# Altium schematic sheet pqm_v2_page2.SchDoc
size A4
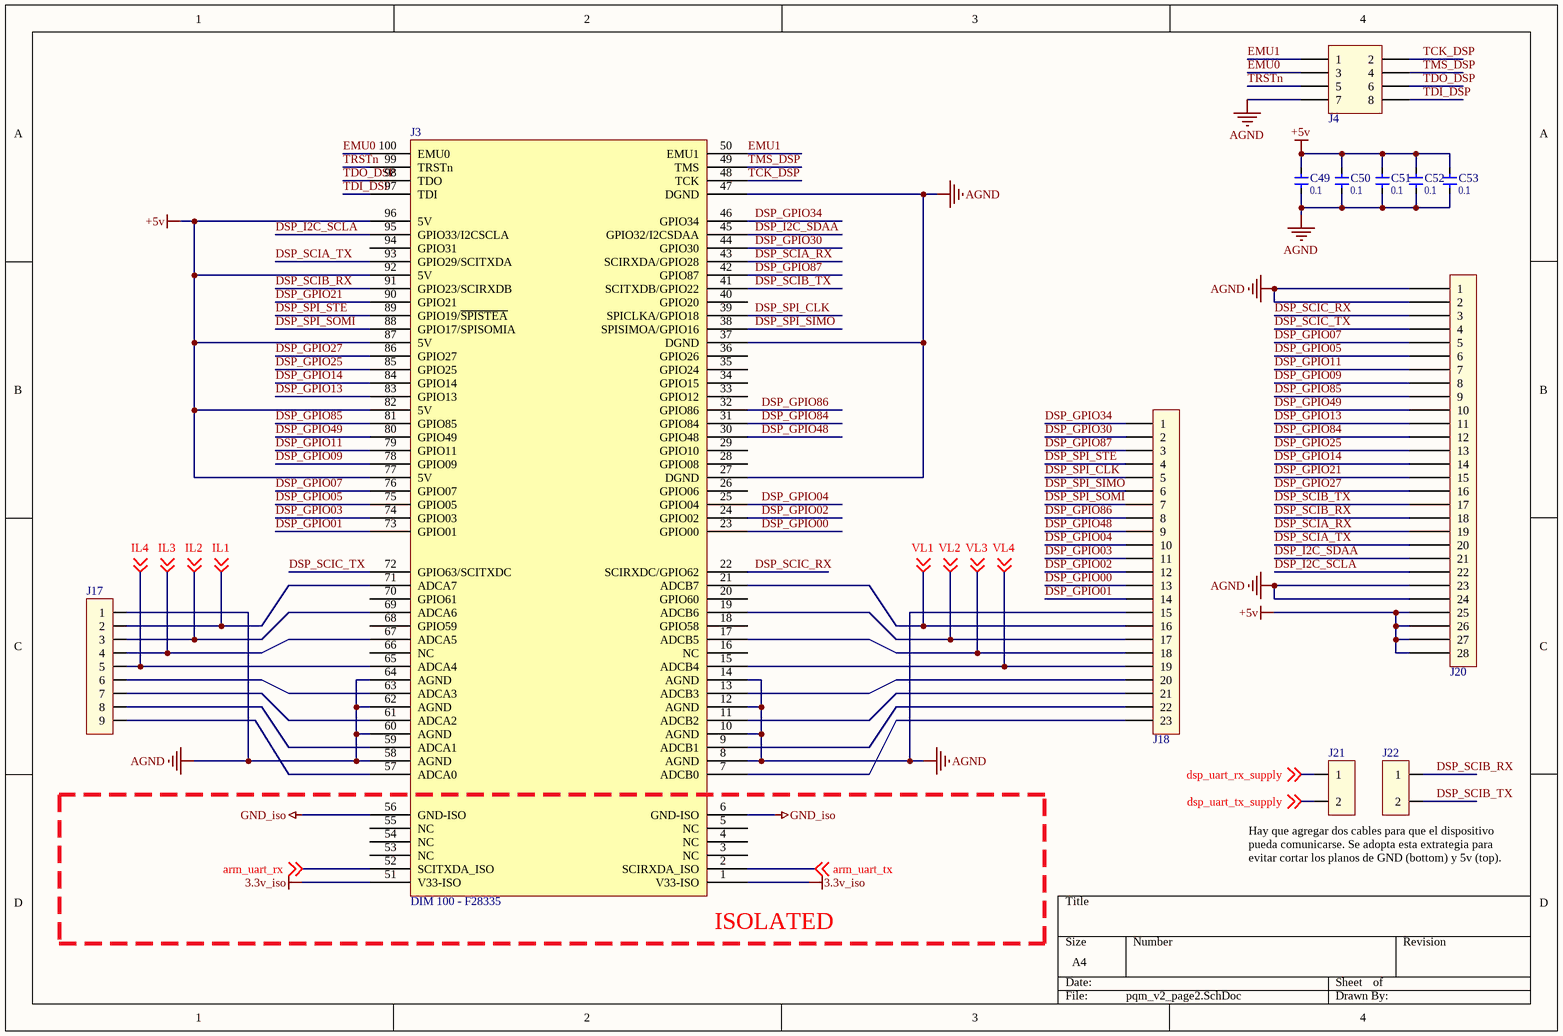
[diagram p0: pqm_v2_page2.SchDoc]

## Parts
C49  value 0.1  [CAPC2013X110N]  (hidden comment: CAP_CC0805KRX7R8BB104_YAGEO)
C50  value 0.1  [CAPC2013X110N]  (hidden comment: CAP_CC0805KRX7R8BB104_YAGEO)
C51  value 0.1  [CAPC2013X110N]  (hidden comment: CAP_CC0805KRX7R8BB104_YAGEO)
C52  value 0.1  [CAPC2013X110N]  (hidden comment: CAP_CC0805KRX7R8BB104_YAGEO)
C53  value 0.1  [CAPC2013X110N]  (hidden comment: CAP_CC0805KRX7R8BB104_YAGEO)
J3  DIM 100 - F28335  [DIMM1.27-2V100]
J4  CON_Header_2X4  [HDR2X4]  (value not drawn)
J17  COM_HeaderX9  [HDRX9]  (value not drawn)
J18  Header_DSP_1  [HEADER_DSP_1]  (value not drawn)
J20  CON_HeaderX30  [HeaderX30]  (value not drawn)
J21  CON_RADX2b  [RAD2b]  (value not drawn)
J22  CON_RADX2b  [RAD2b]  (value not drawn)

## Nets
3.3v_iso: J3.1(V33-ISO) J3.51(V33-ISO)
+5v: C49.1(T1) C50.1(T1) C51.1(T1) C52.1(T1) C53.1(T1) J3.77(5V) J3.82(5V) J3.87(5V) J3.92(5V) J3.96(5V) J20.25 J20.26 J20.27 J20.28
AGND: C49.2(T2) C50.2(T2) C51.2(T2) C52.2(T2) C53.2(T2) J3.8(AGND) J3.10(AGND) J3.12(AGND) J3.14(AGND) J3.27(DGND) J3.37(DGND) J3.47(DGND) J3.58(AGND) J3.60(AGND) J3.62(AGND) J3.64(AGND) J4.7 J17.1 J18.15 J20.1 J20.2 J20.23 J20.24
GND_iso: J3.6(GND-ISO) J3.56(GND-ISO)
arm_uart_rx: J3.52(SCITXDA_ISO) ; off-sheet arm_uart_rx
arm_uart_tx: J3.2(SCIRXDA_ISO) ; off-sheet arm_uart_tx
DSP_GPIO00: J3.23(GPIO00) J18.13
DSP_GPIO01: J3.73(GPIO01) J18.14
DSP_GPIO02: J3.24(GPIO02) J18.12
DSP_GPIO03: J3.74(GPIO03) J18.11
DSP_GPIO04: J3.25(GPIO04) J18.10
DSP_GPIO05: J3.75(GPIO05) J20.6
DSP_GPIO07: J3.76(GPIO07) J20.5
DSP_GPIO09: J3.78(GPIO09) J20.8
DSP_GPIO11: J3.79(GPIO11) J20.7
DSP_GPIO13: J3.83(GPIO13) J20.11
DSP_GPIO14: J3.84(GPIO14) J20.14
DSP_GPIO21: J3.90(GPIO21) J20.15
DSP_GPIO25: J3.85(GPIO25) J20.13
DSP_GPIO27: J3.86(GPIO27) J20.16
DSP_GPIO30: J3.44(GPIO30) J18.2
DSP_GPIO34: J3.46(GPIO34) J18.1
DSP_GPIO48: J3.30(GPIO48) J18.9
DSP_GPIO49: J3.80(GPIO49) J20.10
DSP_GPIO84: J3.31(GPIO84) J20.12
DSP_GPIO85: J3.81(GPIO85) J20.9
DSP_GPIO86: J3.32(GPIO86) J18.8
DSP_GPIO87: J3.42(GPIO87) J18.3
DSP_I2C_SCLA: J3.95(GPIO33/I2CSCLA) J20.22
DSP_I2C_SDAA: J3.45(GPIO32/I2CSDAA) J20.21
DSP_SCIA_RX: J3.43(SCIRXDA/GPIO28) J20.19
DSP_SCIA_TX: J3.93(GPIO29/SCITXDA) J20.20
DSP_SCIB_RX: J3.91(GPIO23/SCIRXDB) J20.18 J22.1
DSP_SCIB_TX: J3.41(SCITXDB/GPIO22) J20.17 J22.2
DSP_SCIC_RX: J3.22(SCIRXDC/GPIO62) J20.3
DSP_SCIC_TX: J3.72(GPIO63/SCITXDC) J20.4
DSP_SPI_CLK: J3.39(SPICLKA/GPIO18) J18.5
DSP_SPI_SIMO: J3.38(SPISIMOA/GPIO16) J18.6
DSP_SPI_SOMI: J3.88(GPIO17/SPISOMIA) J18.7
DSP_SPI_STE: J3.89(GPIO19/~{SPISTEA}) J18.4
dsp_uart_rx_supply: J21.1 ; off-sheet dsp_uart_rx_supply
dsp_uart_tx_supply: J21.2 ; off-sheet dsp_uart_tx_supply
EMU0: J3.100(EMU0) J4.3
EMU1: J3.50(EMU1) J4.1
IL1: J3.71(ADCA7) J17.2 ; off-sheet IL1
IL2: J3.69(ADCA6) J17.3 ; off-sheet IL2
IL3: J3.67(ADCA5) J17.4 ; off-sheet IL3
IL4: J3.65(ADCA4) J17.5 ; off-sheet IL4
TCK_DSP: J3.48(TCK) J4.2
TDI_DSP: J3.97(TDI) J4.8
TDO_DSP: J3.98(TDO) J4.6
TMS_DSP: J3.49(TMS) J4.4
TRSTn: J3.99(TRSTn) J4.5
VL1: J3.21(ADCB7) J18.16 ; off-sheet VL1
VL2: J3.19(ADCB6) J18.17 ; off-sheet VL2
VL3: J3.17(ADCB5) J18.18 ; off-sheet VL3
VL4: J3.15(ADCB4) J18.19 ; off-sheet VL4
NetJ3_7: J3.7(ADCB0) J18.23
NetJ3_9: J3.9(ADCB1) J18.22
NetJ3_11: J3.11(ADCB2) J18.21
NetJ3_13: J3.13(ADCB3) J18.20
NetJ3_57: J3.57(ADCA0) J17.9
NetJ3_59: J3.59(ADCA1) J17.8
NetJ3_61: J3.61(ADCA2) J17.7
NetJ3_63: J3.63(ADCA3) J17.6

Not connected (* = marked no-connect by the designer): J3 3(NC) 4(NC) 5(NC) 16(NC) 18(GPIO58) 20(GPIO60) 26(GPIO06) 28(GPIO08) 29(GPIO10) 33(GPIO12) 34(GPIO15) 35(GPIO24) 36(GPIO26) 40(GPIO20) 53(NC) 54(NC) 55(NC) 66(NC) 68(GPIO59) 70(GPIO61) 94(GPIO31)

## Notes on the sheet
- Hay que agregar dos cables para que el dispositivo pueda comunicarse. Se adopta esta extrategia para evitar cortar los planos de GND (bottom) y 5v (top).
- (near J3) ISOLATED

## Library data of the parts
C49-C53 = CAP_CC0805KRX7R8BB104_YAGEO: CAP CER 0.1UF 25V 10% X7R 0805; Manufacturer: Yageo; Supplier: *; Tolerance: 10%; Power Rating: *; Voltage Rating: 25V; BOM Populate: *; Digikey Part Number: 311-1141-1-ND; Mouser Part Number: 603-CC805KRX7R8BB104; Manufacturer Part Number: CC0805KRX7R8BB104
J3 = CON_DIM_100: Manufacturer Part Number: 5390213-1; Digikey Part Number: A121375-ND; Mouser Part Number: 571-5390213-1